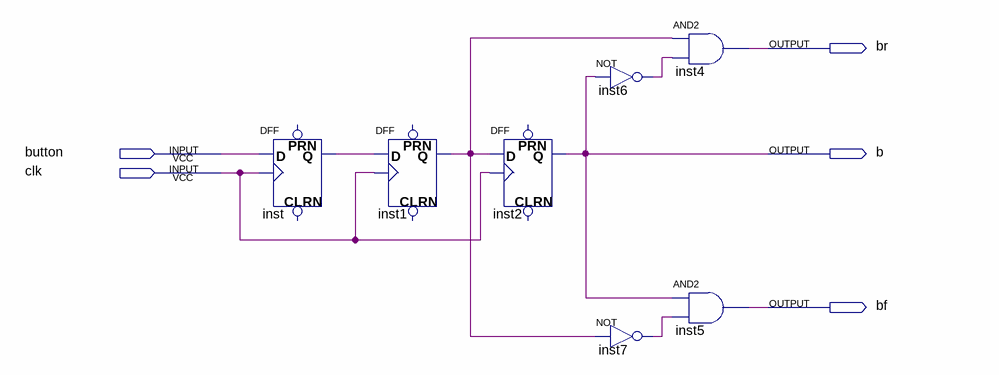
[diagram p0: schematic sheet]
// Quartus schematic button_sync.bdf as structural Verilog: 7 symbols, 5 pins
module button_sync (
  input  button,
  input  clk,
  output br,
  output b,
  output bf
);

  wire inst1_q, inst6_out, inst7_out, inst_q;

  DFF inst (.CLK(clk), .D(button), .Q(inst_q));  // open: CLRN, PRN
  DFF inst1 (.CLK(clk), .D(inst_q), .Q(inst1_q));  // open: CLRN, PRN
  DFF inst2 (.CLK(clk), .D(inst1_q), .Q(b));  // open: CLRN, PRN
  not inst6 (inst6_out, b);
  not inst7 (inst7_out, inst1_q);
  and inst4 (br, inst1_q, inst6_out);
  and inst5 (bf, b, inst7_out);
endmodule
